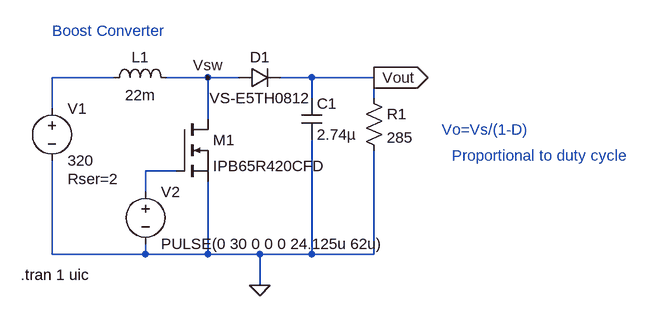
[diagram p0: schematic boost_converter.asc]
boost_converter.asc, the LTspice schematic file:
Version 4
SHEET 1 888 680
WIRE 64 80 -32 80
WIRE 208 80 144 80
WIRE 256 80 208 80
WIRE 368 80 320 80
WIRE 464 80 368 80
WIRE 368 112 368 80
WIRE 464 112 464 80
WIRE -32 128 -32 80
WIRE 208 144 208 80
WIRE 160 224 112 224
WIRE 112 256 112 224
WIRE -32 352 -32 208
WIRE 112 352 112 336
WIRE 112 352 -32 352
WIRE 208 352 208 240
WIRE 208 352 112 352
WIRE 288 352 208 352
WIRE 368 352 368 176
WIRE 368 352 288 352
WIRE 464 352 464 192
WIRE 464 352 368 352
WIRE 288 400 288 352
FLAG 288 400 0
FLAG 464 80 Vout
IOPIN 464 80 Out
FLAG 208 80 Vsw
SYMBOL voltage -32 112 R0
WINDOW 123 0 0 Left 0
WINDOW 39 24 124 Left 2
SYMATTR SpiceLine Rser=2
SYMATTR InstName V1
SYMATTR Value 320
SYMBOL ind 48 96 R270
WINDOW 0 32 56 VTop 2
WINDOW 3 5 56 VBottom 2
SYMATTR InstName L1
SYMATTR Value 22m
SYMATTR SpiceLine Rser=0 Rpar=2.0724e+06 Cpar=0
SYMBOL nmos 160 144 R0
SYMATTR InstName M1
SYMATTR Value IPB65R420CFD
SYMBOL voltage 112 240 R0
WINDOW 123 0 0 Left 0
WINDOW 39 0 0 Left 0
SYMATTR InstName V2
SYMATTR Value PULSE(0 30 0 0 0 24.125u 62u)
SYMBOL cap 352 112 R0
SYMATTR InstName C1
SYMATTR Value 2.74µ
SYMBOL res 448 96 R0
SYMATTR InstName R1
SYMATTR Value 285
SYMBOL diode 256 96 R270
WINDOW 0 32 32 VTop 2
WINDOW 3 0 32 VBottom 2
SYMATTR InstName D1
SYMATTR Value VS-E5TH0812
TEXT -80 384 Left 2 !.tran 1 uic
TEXT -32 8 Left 2 ;Boost Converter
TEXT 568 160 Left 2 ;Vo=Vs/(1-D)
TEXT 584 200 Left 2 ;Proportional to duty cycle

The netlist it stands for:
* boost_converter.asc
V1 N001 0 320 Rser=2
L1 N001 Vsw 22m Rser=0 Rpar=2.0724e+06 Cpar=0
M1 Vsw N002 0 0 IPB65R420CFD
V2 N002 0 PULSE(0 30 0 0 0 24.125u 62u)
C1 Vout 0 2.74µ
R1 Vout 0 285
D1 Vsw Vout VS-E5TH0812
.model D D
.lib standard.dio
.model NMOS NMOS
.model PMOS PMOS
.lib standard.mos
.tran 1 uic
* Boost Converter
* Vo=Vs/(1-D)
* Proportional to duty cycle
.backanno
.end